# Altium schematic sheet MT6631.SchDoc
size A3; SheetNumber: 26; SheetTotal: 36
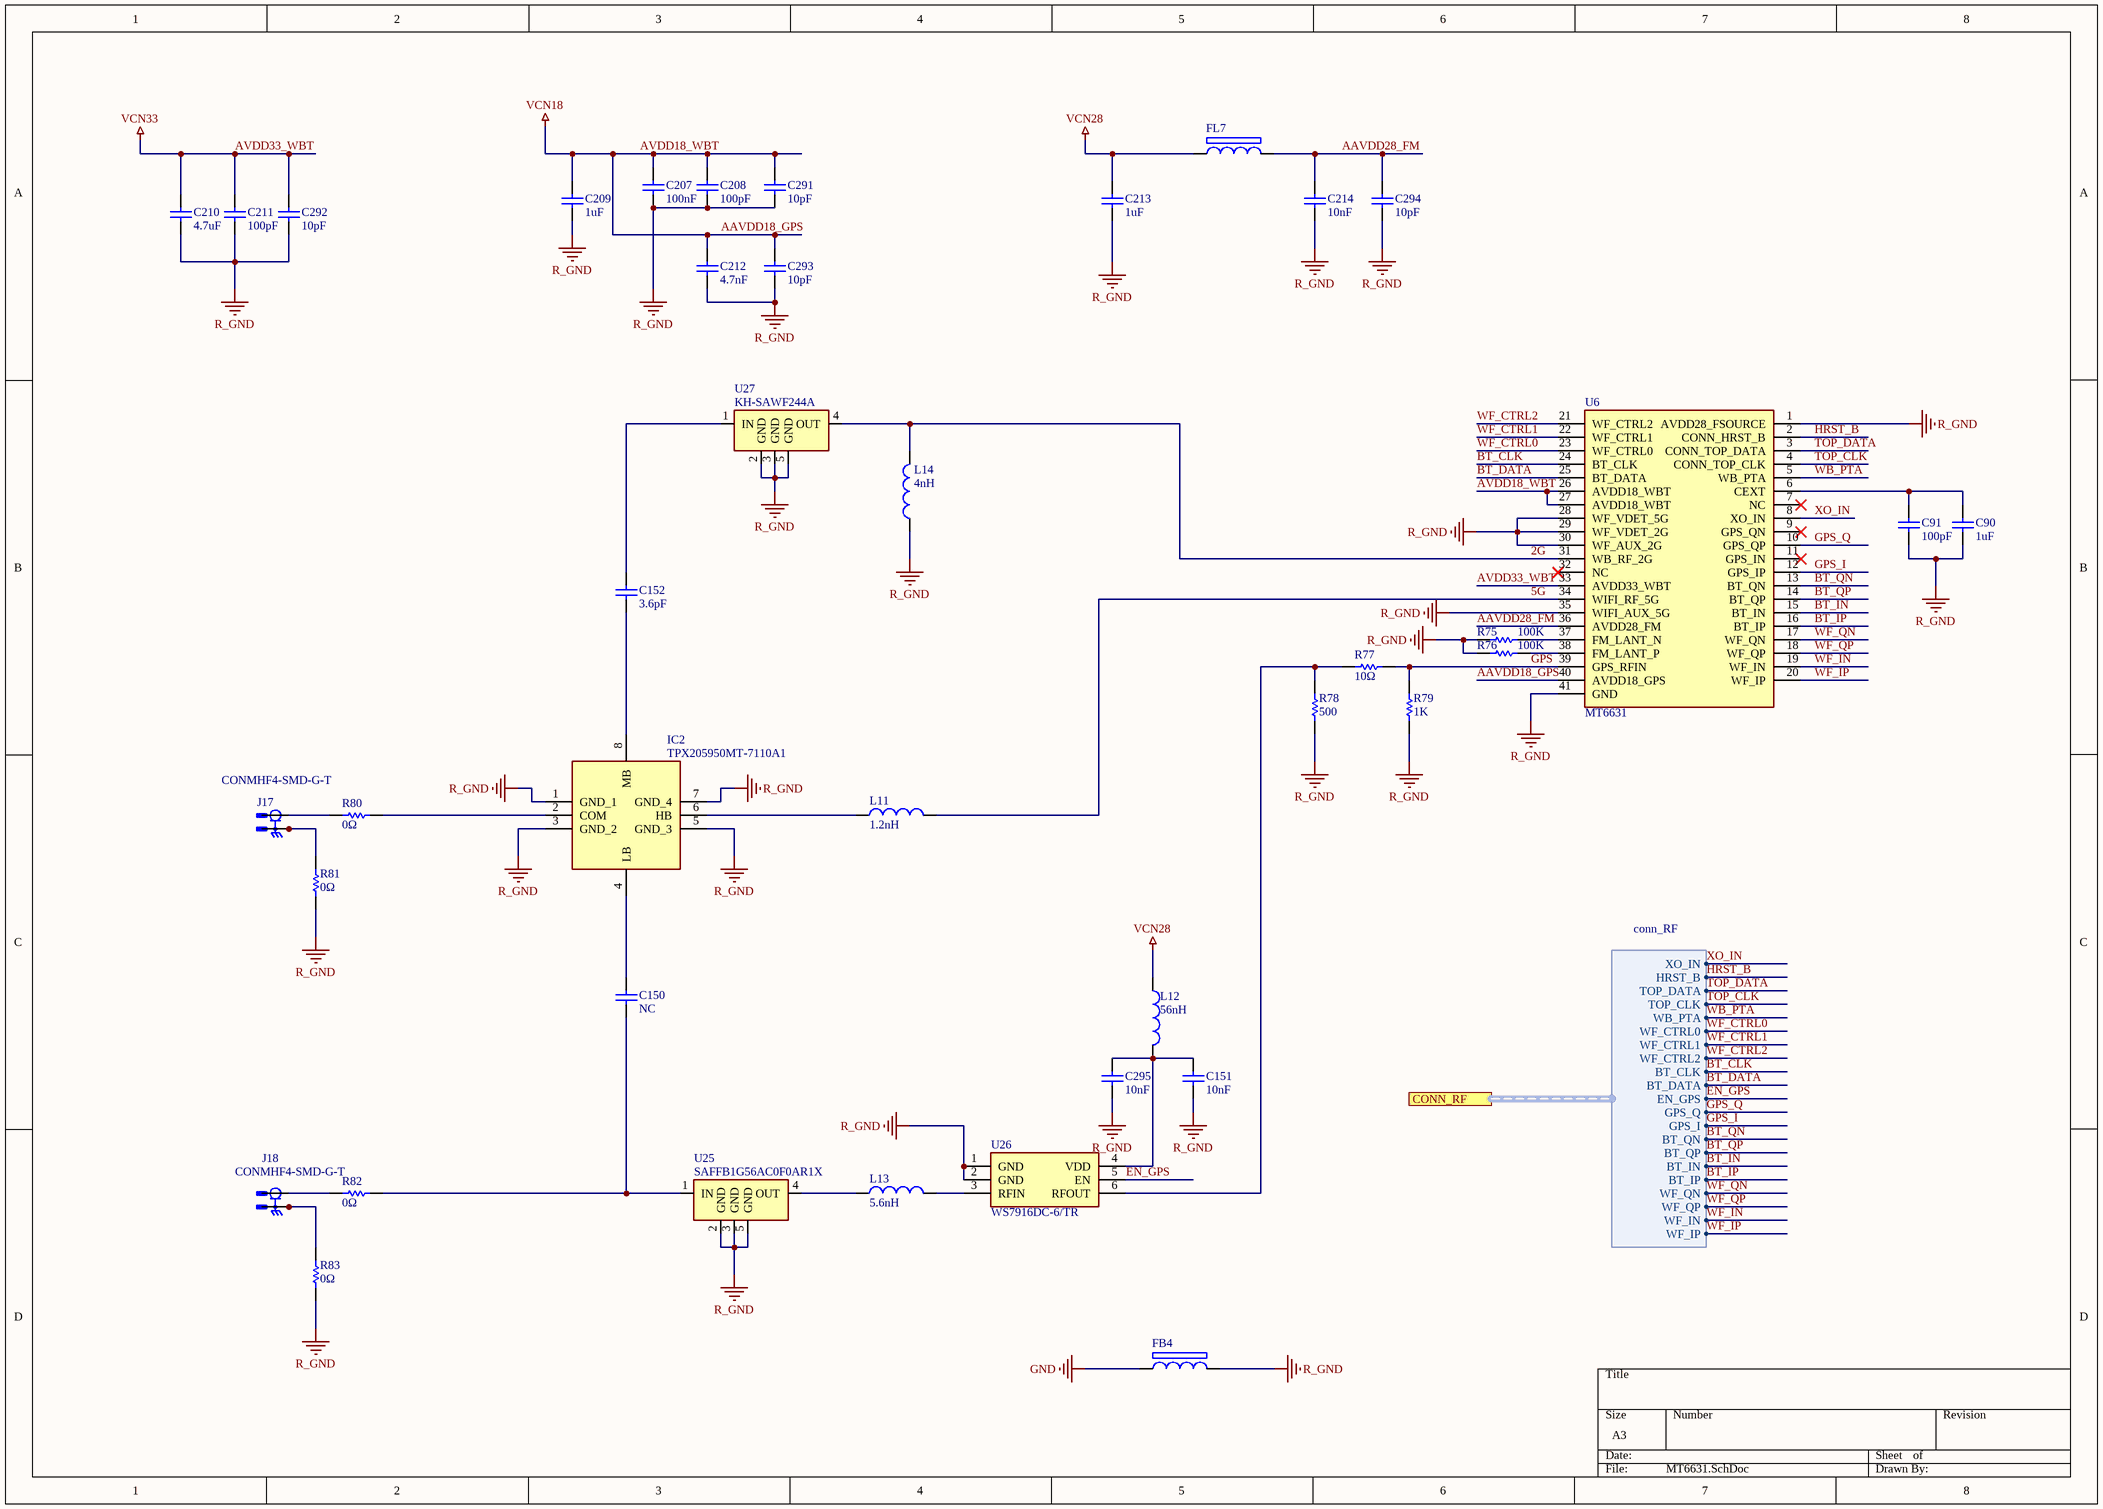
[diagram p0: MT6631.SchDoc]

## Parts
C90  value 1uF  [C0805]  (hidden comment: C0805)
C91  value 100pF  [C0402]  (hidden comment: C0402)
C150  value NC  [C0402]  (hidden comment: C0402)
C151  value 10nF  [C0603]  (hidden comment: C0603)
C152  value 3.6pF  [C0402]  (hidden comment: C0402)
C207  value 100nF  [C0603]  (hidden comment: C0603)
C208  value 100pF  [C0402]  (hidden comment: C0402)
C209  value 1uF  [C0805]  (hidden comment: C0805)
C210  value 4.7uF  [C0805]  (hidden comment: C0805)
C211  value 100pF  [C0402]  (hidden comment: C0402)
C212  value 4.7nF  [C0603]  (hidden comment: C0603)
C213  value 1uF  [C0805]  (hidden comment: C0805)
C214  value 10nF  [C0603]  (hidden comment: C0603)
C291  value 10pF  [C0402]  (hidden comment: C0402)
C292  value 10pF  [C0402]  (hidden comment: C0402)
C293  value 10pF  [C0402]  (hidden comment: C0402)
C294  value 10pF  [C0402]  (hidden comment: C0402)
C295  value 10nF  [C0603]  (hidden comment: C0603)
FB4  BLM18KG121TN1D  [BLM18EG101TH1D]  (value not drawn)
FL7  BLM18BD252SN1D  [BEADC1608X95N]  (value not drawn)
IC2  TPX205950MT-7110A1  [TPX205950MT7110A1]
J17  CONMHF4-SMD-G-T  [LINX_CONMHF4-SMD-G-T]
J18  CONMHF4-SMD-G-T  [LINX_CONMHF4-SMD-G-T]
L11  value 1.2nH  [L0402]  (hidden comment: L0402)
L12  value 56nH  [L0402]  (hidden comment: L0402)
L13  value 5.6nH  [L0402]  (hidden comment: L0402)
L14  value 4nH  [L0402]  (hidden comment: L0402)
R75  value 100K  [R0603]  (hidden comment: R0603)
R76  value 100K  [R0603]  (hidden comment: R0603)
R77  value 10Ω  [R0603]  (hidden comment: R0603)
R78  value 500  [R0603]  (hidden comment: R0603)
R79  value 1K  [R0603]  (hidden comment: R0603)
R80  value 0Ω  [R0603]  (hidden comment: R0603)
R81  value 0Ω  [R0603]  (hidden comment: R0603)
R82  value 0Ω  [R0603]  (hidden comment: R0603)
R83  value 0Ω  [R0603]  (hidden comment: R0603)
U6  MT6631  [MT6631]
U25  SAFFB1G56AC0F0AR1X  [SAFFB1G56AC0F0AR1X]
U26  WS7916DC-6/TR  [WS7916DC-6/TR]
U27  KH-SAWF244A  [KH-SAWF244A]

## Ports
CONN_RF (harness conn_RF, see main[4000,4600], MT8365[5700,9000], MT8365_CONN[700,7400])

## Harnesses
conn_RF: XO_IN, HRST_B, TOP_DATA, TOP_CLK, WB_PTA, WF_CTRL0, WF_CTRL1, WF_CTRL2, BT_CLK, BT_DATA, GPS_Q, GPS_I, BT_QN, BT_QP, BT_IN, BT_IP, WF_QN, WF_QP, WF_IN, WF_IP, EN_GPS

## Nets
AAVDD18_GPS: C207.2 C208.2 C209.2 C212.2 C291.2 C293.2 U6.26(AVDD18_WBT) U6.27(AVDD18_WBT) U6.40(AVDD18_GPS)  [also labelled AVDD18_WBT, VCN18]
AVDD33_WBT: C210.2 C211.2 C292.2 U6.33(AVDD33_WBT)  [also labelled VCN33]
GND: FB4.1
R_GND: C90.1 C91.1 C151.1 C207.1 C208.1 C209.1 C210.1 C211.1 C212.1 C213.1 C214.1 C291.1 C292.1 C293.1 C294.1 C295.1 FB4.2 IC2.1(GND_1) IC2.3(GND_2) IC2.5(GND_3) IC2.7(GND_4) L14.1 R75.1 R76.1 R78.1 R79.1 R81.1 R83.1 U6.1(AVDD28_FSOURCE) U6.28(WF_VDET_5G) U6.29(WF_VDET_2G) U6.30(WF_AUX_2G) U6.35(WIFI_AUX_5G) U6.41(GND) U25.2(GND) U25.3(GND) U25.5(GND) U26.1(GND) U26.2(GND) U27.2(GND) U27.3(GND) U27.5(GND)
VCN28: C213.2 FL7.1 L12.1
2G: L14.2 U6.31(WB_RF_2G) U27.4(OUT)
5G: L11.2 U6.34(WIFI_RF_5G)
AAVDD28_FM: C214.2 C294.2 FL7.2 U6.36(AVDD28_FM)
BT_CLK: U6.24(BT_CLK) ; port CONN_RF.BT_CLK
BT_DATA: U6.25(BT_DATA) ; port CONN_RF.BT_DATA
BT_IN: U6.15(BT_IN) ; port CONN_RF.BT_IN
BT_IP: U6.16(BT_IP) ; port CONN_RF.BT_IP
BT_QN: U6.13(BT_QN) ; port CONN_RF.BT_QN
BT_QP: U6.14(BT_QP) ; port CONN_RF.BT_QP
EN_GPS: U26.5(EN) ; port CONN_RF.EN_GPS
GPS: R77.2 R79.2 U6.39(GPS_RFIN)
GPS_I: U6.12(GPS_IP) ; port CONN_RF.GPS_I
GPS_Q: U6.10(GPS_QP) ; port CONN_RF.GPS_Q
HRST_B: U6.2(CONN_HRST_B) ; port CONN_RF.HRST_B
TOP_CLK: U6.4(CONN_TOP_CLK) ; port CONN_RF.TOP_CLK
TOP_DATA: U6.3(CONN_TOP_DATA) ; port CONN_RF.TOP_DATA
WB_PTA: U6.5(WB_PTA) ; port CONN_RF.WB_PTA
WF_CTRL0: U6.23(WF_CTRL0) ; port CONN_RF.WF_CTRL0
WF_CTRL1: U6.22(WF_CTRL1) ; port CONN_RF.WF_CTRL1
WF_CTRL2: U6.21(WF_CTRL2) ; port CONN_RF.WF_CTRL2
WF_IN: U6.19(WF_IN) ; port CONN_RF.WF_IN
WF_IP: U6.20(WF_IP) ; port CONN_RF.WF_IP
WF_QN: U6.17(WF_QN) ; port CONN_RF.WF_QN
WF_QP: U6.18(WF_QP) ; port CONN_RF.WF_QP
XO_IN: U6.8(XO_IN) ; port CONN_RF.XO_IN
NetC90_2: C90.2 C91.2 U6.6(CEXT)
NetC150_1: C150.1 R82.2 U25.1(IN)
NetC150_2: C150.2 IC2.4(LB)
NetC151_2: C151.2 C295.2 L12.2 U26.4(VDD)
NetC152_1: C152.1 IC2.8(MB)
NetC152_2: C152.2 U27.1(IN)
NetIC2_2: IC2.2(COM) R80.2
NetIC2_6: IC2.6(HB) L11.1
NetJ17_1: J17.1 R80.1
NetJ17_S1: J17.S1 J17.S2 J17.S3 R81.2
NetJ18_1: J18.1 R82.1
NetJ18_S1: J18.S1 J18.S2 J18.S3 R83.2
NetL13_1: L13.1 U25.4(OUT)
NetL13_2: L13.2 U26.3(RFIN)
NetR75_2: R75.2 U6.37(FM_LANT_N)
NetR76_2: R76.2 U6.38(FM_LANT_P)
NetR77_1: R77.1 R78.2 U26.6(RFOUT)

Not connected (* = marked no-connect by the designer): U6 7(NC)* 9(GPS_QN)* 11(GPS_IN)* 32(NC)*

## Library data of the parts
FB4 = BLM18KG121TN1D: Ferrite Bead. 0603. 3A.  DC Resistance(DCR) 30mΩ. 120Ω@100MHz; Manufacturer_Name: Murata Electronics; Datasheet Link: http://www.murata.com/~/media/webrenewal/support/library/catalog/products/emc/emifil/c31e.ashx?la=en-gb; Height: 0.75mm; Manufacturer_Part_Number: BLM18KG121TN1D; Mouser Part Number: 81-BLM18KG121TN1D; Mouser Price/Stock: https://www.mouser.co.uk/ProductDetail/Murata-Electronics/BLM18KG121TN1D?qs=rvfpa0%252BU10PYAwVv0fw24Q%3D%3D; Arrow Part Number: BLM18KG121TN1D; Arrow Price/Stock: https://www.arrow.com/en/products/blm18kg121tn1d/murata-manufacturing?utm_currency=USD&region=nac
FL7 = BLM18BD252SN1D: Inductor Chip Bead 2.5KOhm 25% 100MHz Ferrite 50mA 0603
IC2 = TPX205950MT-7110A1: wifi, bluetooth, GPS. 2.4GHz, 5GHz, 1.6GHz; Manufacturer_Name: TDK; Datasheet Link: https://product.tdk.com/system/files/dam/doc/product/rf/rf/triplexer/catalog/rf_tpx_tpx205950mt-7110a1_en.pdf; Height: 1mm; Manufacturer_Part_Number: TPX205950MT-7110A1; Mouser Part Number: 810-TPX20595MT7110A1; Mouser Price/Stock: https://www.mouser.co.uk/ProductDetail/TDK/TPX205950MT-7110A1?qs=Vpv2%252BhtnxQJqTIwP0boi4g%3D%3D
J17 J18 = CONMHF4-SMD-G-T: MHF4 Jack 50 Ohm PCB Surface Mount
U25 = SAFFB1G56AC0F0AR1X: lọc thông giải GPS
U26 = WS7916DC-6/TR: khuếch đại tín hiệu GPS
U27 = KH-SAWF244A: bộ lọc thông dải 2.4GHz